# EAGLE design Geiger_counter_uC_section (EAGLE 9.2.2)
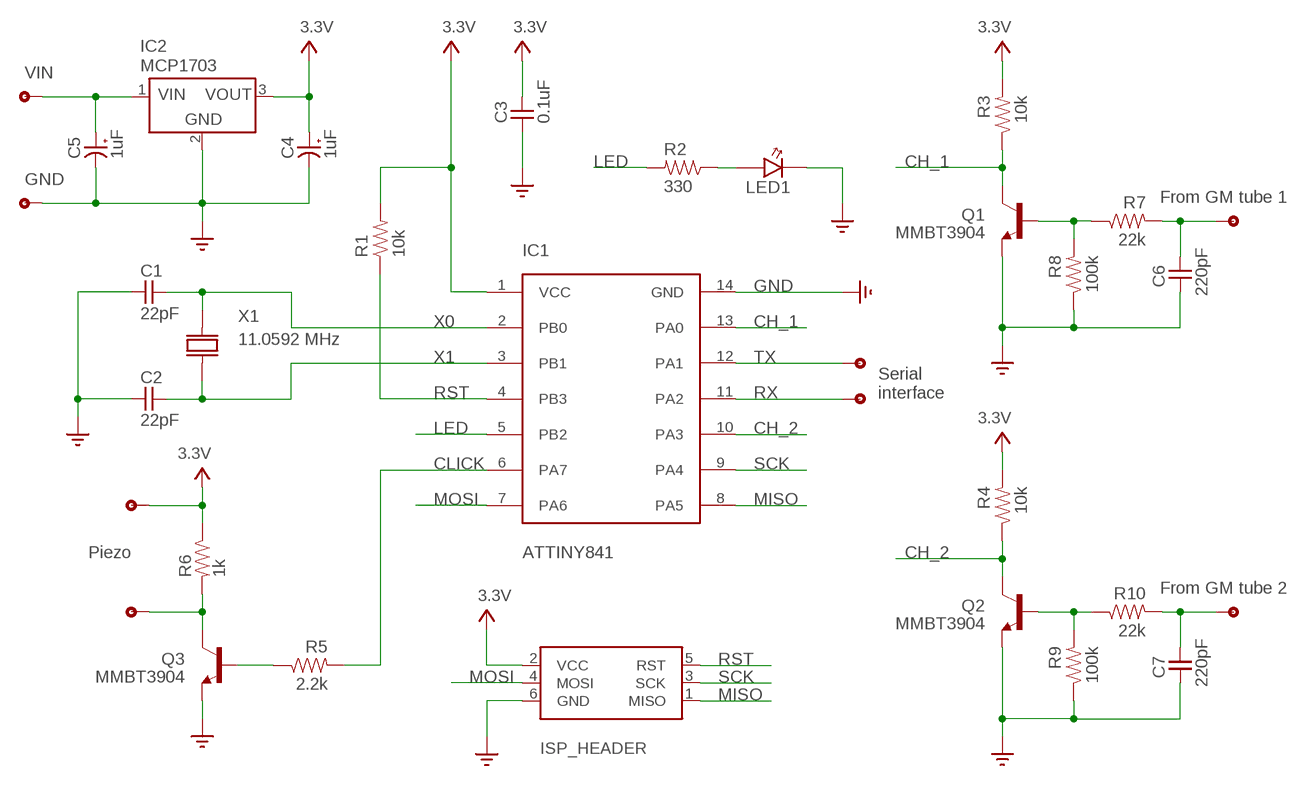
[diagram p0: schematic, sheet 1]

## Parts
C1  22pF  CAPACITOR0805  [0805]
C2  22pF  CAPACITOR0805  [0805]
C3  0.1uF  CAPACITOR0805  [0805]
C4  1uF  CAPACITOR+  [1206]
C5  1uF  CAPACITOR+  [1206]
C6  220pF  CAPACITOR0805  [0805]
C7  220pF  CAPACITOR0805  [0805]
IC1  ATTINY841  ATTINY841SO-14  [SO14]
IC2  MCP1703  [SOT-23A]
ISP_HEADER  ISP header  ISP_HEADER  [ISP_HEADER]
LED1  LED0805  [0805]
Q1  MMBT3904  [SOT-23A]
Q2  MMBT3904  [SOT-23A]
Q3  MMBT3904  [SOT-23A]
R1  10k  RESISTORSMD0805  [0805]
R2  330  RESISTORSMD0805  [0805]
R3  10k  RESISTORSMD0805  [0805]
R4  10k  RESISTORSMD0805  [0805]
R5  2.2k  RESISTORSMD0805  [0805]
R6  1k  RESISTORSMD0805  [0805]
R7  22k  RESISTORSMD0805  [0805]
R8  100k  RESISTORSMD0805  [0805]
R9  100k  RESISTORSMD0805  [0805]
R10  22k  RESISTORSMD0805  [0805]
TP1  TPSMALL  [TP_SMALL]
TP2  TPSMALL  [TP_SMALL]
TP3  TPSMALL  [TP_SMALL]
TP4  TPSMALL  [TP_SMALL]
TP5  TP  [TP]
TP6  TP  [TP]
TP7  TPSMALL  [TP_SMALL]
TP8  TPSMALL  [TP_SMALL]
X1  11.0592 MHz  ABM3  [ABM3-2SMD]

## Nets
3V3: C3.2 C4.1 IC1.1(VCC) IC2.3(VOUT) ISP_HEADER.2(VCC) R1.2 R3.2 R4.2 R6.1 TP4.TP_SMALL ; supply symbol labelled 3.3V
CH_1: IC1.13(PA0) Q1.1(C) R3.1
CH_2: IC1.10(PA3) Q2.1(C) R4.1
CLICK: IC1.6(PA7) R5.2
GND: C1.1 C2.1 C3.1 C4.2 C5.2 C6.2 C7.2 IC1.14(GND) IC2.2(GND) ISP_HEADER.6(GND) LED1.2(K) Q1.3(E) Q2.3(E) Q3.3(E) R8.1 R9.1 TP8.TP_SMALL ; supply symbol labelled DGND
LED: IC1.5(PB2) R2.2
MISO: IC1.8(PA5) ISP_HEADER.1(MISO)
MOSI: IC1.7(PA6) ISP_HEADER.4(MOSI)
N$1: LED1.1(A) R2.1
N$2: Q3.2(B) R5.1
N$3: Q3.1(C) R6.2 TP3.TP_SMALL
N$4: Q1.2(B) R7.1 R8.2
N$5: C6.1 R7.2 TP5.P$1
N$6: Q2.2(B) R9.2 R10.1
N$8: C7.1 R10.2 TP6.P$1
RST: IC1.4(PB3) ISP_HEADER.5(RST) R1.1
RX: IC1.11(PA2) TP2.TP_SMALL
SCK: IC1.9(PA4) ISP_HEADER.3(SCK)
TX: IC1.12(PA1) TP1.TP_SMALL
VIN: C5.1 IC2.1(VIN) TP7.TP_SMALL
X0: C1.2 IC1.2(PB0) X1.P$2
X1: C2.2 IC1.3(PB1) X1.P$1

## Notes on the sheet
- From GM tube 1
- Serial
  interface
- Piezo
- From GM tube 2

## Library data of the parts
C1-C3 C6 C7 = thomas_library:CAPACITOR: This is a capacitor
C4 C5 = thomas_library:CAPACITOR+: This is a polarized capacitor
IC1 = thomas_library:ATTINY841
IC2 = thomas_library:MCP1703: The MCP1703 is a LDO regulator from Microchip
ISP_HEADER = thomas_library:ISP_HEADER: This is a six-pin ISP header for the ATMega Microcontroller
LED1 = thomas_library:LED: This is a Light-Emitting Diode
Q1-Q3 = thomas_library:MMBT3904: This is a SMT bipolar NPN transistor.
R1-R10 = thomas_library:RESISTOR: This is a resistor
TP1-TP8 = thomas_library:TP: A test point
X1 = thomas_library:ABM3: ABM3 crystal from Abracom

## Board
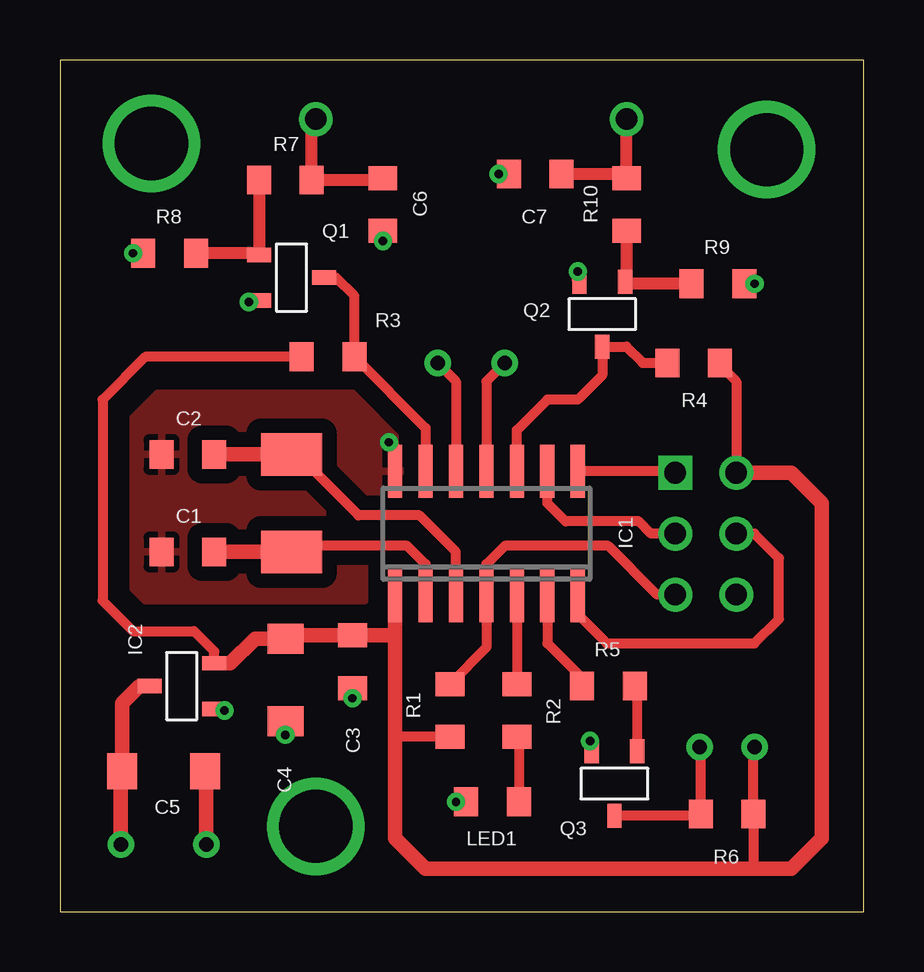
[diagram p1: board, top side]
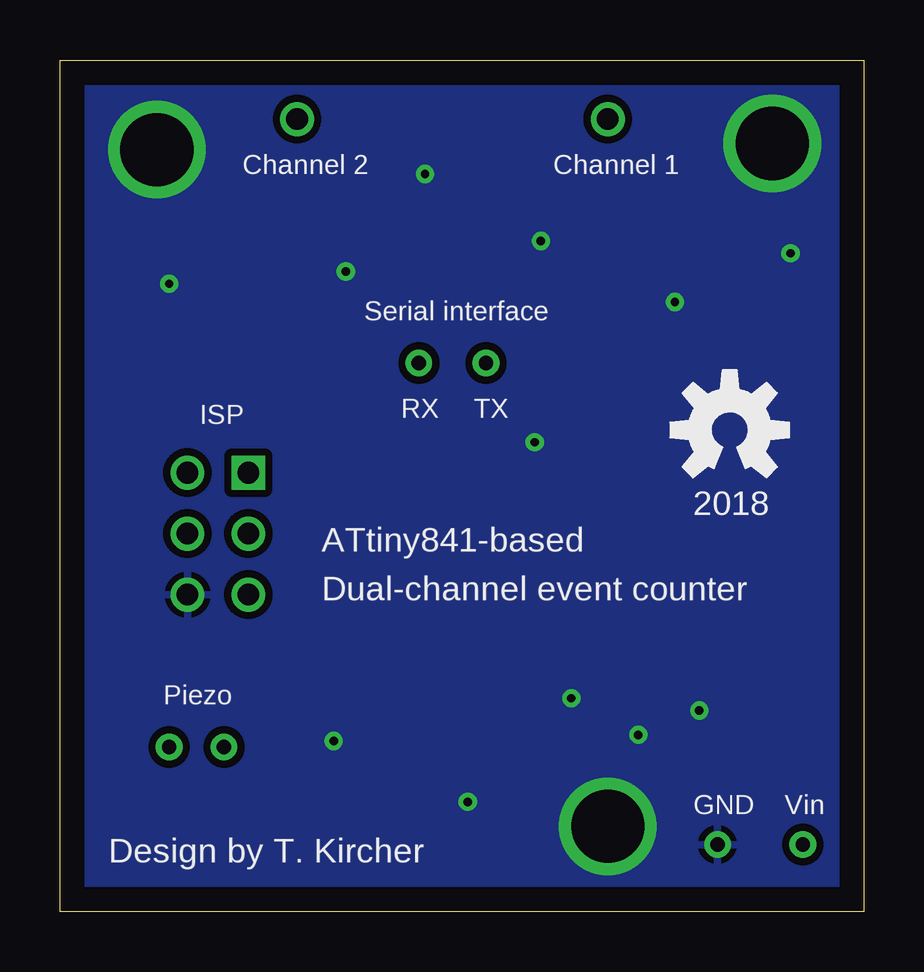
[diagram p2: board, bottom side, seen from below]

Size 33.51 x 35.48 mm. Coordinates in mm from the lower left corner, seen from the top.
Outline: 0,0 33.51,0 33.51,35.48 0,35.48 0,0
Copper layers (1*16): Top 0.035mm / dielectric 1.5mm / Bottom 0.035mm
Design rules "default": minimum track width 6mil, minimum drill 0.35mm, track to track 6mil, track to pad 6mil, pad to pad 6mil, via to via 6mil, smd to smd 6mil, copper to edge 40mil, drill to drill 6mil, minimum pad ring 10mil, minimum via ring 8mil, stop-mask expansion 4mil, vias tented up to drill 0mil, thermal gap 10mil

### Footprints (pad centres in the part's own frame; a part is rotated, then mirrored left to right if it is on the bottom)
0805 = smd 1 x 1.2: 1 -1.1,0; 2 1.1,0
1206 = smd 1.25 x 1.5: 1 -1.725,0; 2 1.725,0
SO14 = smd 0.6 x 2.2: 1 -3.81,-2.6; 2 -2.54,-2.6; 3 -1.27,-2.6; 4 0,-2.6; 5 1.27,-2.6; 6 2.54,-2.6; 7 3.81,-2.6; 8 3.81,2.6; 9 2.54,2.6; 10 1.27,2.6; 11 0,2.6; 12 -1.27,2.6; 13 -2.54,2.6; 14 -3.81,2.6
SOT-23A = smd 0.6 x 1: 1 0,1.35; 2 -0.95,-1.35; 3 0.95,-1.35
ISP_HEADER = drill 0.9 square: 1 -2.54,-1.27 | drill 0.9: 2 -2.54,1.27; 3 0,-1.27; 4 0,1.27; 5 2.54,-1.27; 6 2.54,1.27
TP_SMALL = drill 0.6: TP_SMALL 0,0
TP = drill 0.9: P$1 0,0
ABM3-2SMD = smd 1.778 x 2.54: P$1 -2.032,0; P$2 2.032,0

### Placement (x,y rotation side)
C1  5.33,14.99 0 top
C2  5.33,19.05 0 top
C3  12.19,10.41 90 top
C4  9.4,9.65 270 top
C5  4.32,5.84 0 top
C6  13.46,29.46 270 top
C7  19.81,30.73 180 top
IC1  ATTINY641  [SO14]  17.78,15.75 0 top
IC2  5.08,9.4 90 top
ISP_HEADER  26.92,15.75 270 top
LED1  18.03,4.57 180 top
Q1  9.65,26.42 270 top
Q2  22.61,24.89 180 top
Q3  23.11,5.33 180 top
R1  16.26,8.38 270 top
R2  19.05,8.38 90 top
R3  11.18,23.11 180 top
R4  26.42,22.86 0 top
R5  22.86,9.4 180 top
R6  27.81,4.06 180 top
R7  9.4,30.48 0 top
R8  4.57,27.43 0 top
R9  27.43,26.16 180 top
R10  23.62,29.46 90 top
TP1  15.75,22.86 0 top
TP2  18.54,22.86 0 top
TP3  26.67,6.86 0 top
TP4  28.96,6.86 0 top
TP5  10.67,33.02 0 top
TP6  23.62,33.02 0 top
TP7  2.54,2.79 0 top
TP8  6.1,2.79 0 top
U$17  [OSHW-LOGO-M]  5.59,20.07 0 bottom
X1  9.65,17.02 270 top

### Tracks (layer width: path | path; a pad name or v marks a point on that pad's centre or on a via)
3V3
  Top 0.406: R1.2 14.05,7.28 13.97,7.37 | TP4.TP_SMALL 28.91,6.81 R6.1 28.91,1.82 28.96,1.78 | R4.2 27.52,22.78 28.19,22.1 ISP_HEADER.2 | R3.2 3.56,23.11 1.78,21.34 1.78,12.95 3.05,11.68 5.59,11.68 6.43,10.84 IC2.3
  Top 0.61: 13.97,11.51 13.97,7.37 13.97,3.05 15.24,1.78 28.96,1.78 30.48,1.78 31.75,3.05 31.75,17.02 30.48,18.29 ISP_HEADER.2 | C3.2 12.08,11.63 | C3.2 13.97,11.51 | C3.2 9.53,11.51 C4.1 8.13,11.38 7.1,10.35 IC2.3 | 13.97,11.51 IC1.1
CH_1
  Top 0.406: Q1.1 11.51,26.42 12.27,25.65 R3.1 15.24,20.15 IC1.13
CH_2
  Top 0.406: IC1.10 19.05,20.07 20.32,21.34 21.59,21.34 22.61,22.35 Q2.1 23.62,23.54 24.3,22.86 R4.1
CLICK
  Top 0.406: IC1.6 20.32,11.18 21.76,9.74 R5.2
GND  (via drill 0.35, 3.05)
  Top 0.508: Q1.3 8.24,25.4 v7.87,25.4 | C7.2 v18.29,30.73 | v28.96,26.16 R9.1 | v21.59,26.67 21.59,26.31 Q2.3 | C3.1 v12.19,8.89 | LED1.2 v16.51,4.57 | Q3.3 22.16,7.05 v22.1,7.11 | IC1.14 13.97,19.3 v13.72,19.56 | C4.2 v9.4,7.37 | v6.86,8.38 6.5,8.38 IC2.2
  Top 0.61: C5.2 6.1,5.79 TP8.TP_SMALL | C6.2 v13.46,27.94 | R8.1 v3.05,27.43
  other vias: 3.81,32 29.46,31.75 10.67,3.56
  pour Bottom (isolate 0.305): -0.25,36.07 -0.25,-0.25 33.78,-0.25 33.78,36.07
  pour Top (isolate 0.61): 14.22,19.56 12.19,21.59 4.06,21.59 3.05,20.57 3.05,13.46 3.56,12.95 12.7,12.95 12.7,16 14.22,17.53
LED
  Top 0.406: IC1.5 R2.2
MISO
  Top 0.406: IC1.8 25.59,18.35 ISP_HEADER.1
MOSI
  Top 0.406: IC1.7 21.59,12.39 22.8,11.18 28.96,11.18 29.97,12.19 29.97,14.73 28.96,15.75 ISP_HEADER.4
N$1
  Top 0.406: R2.1 19.13,7.2 LED1.1
N$2
  Top 0.406: Q3.2 24.06,9.13 24.04,9.42 R5.1
N$3
  Top 0.406: Q3.1 26.63,3.98 R6.2 26.71,6.86 TP3.TP_SMALL
N$4
  Top 0.508: Q1.2 8.24,27.43 | 8.24,27.43 R8.2 | R7.1 8.3,27.49 8.24,27.43
N$5
  Top 0.508: C6.1 13.38,30.48 R7.2 10.5,32.85 TP5.P$1
N$6
  Top 0.508: R9.2 23.64,26.16 Q2.2 23.62,26.31 R10.1
N$8
  Top 0.508: C7.1 23.45,30.73 R10.2 TP6.P$1
RST
  Top 0.406: ISP_HEADER.5 24.89,13.21 22.86,15.24 18.54,15.24 17.78,14.48 IC1.4 17.78,11.01 R1.1
RX
  Top 0.406: TP2.TP_SMALL 17.78,22.1 IC1.11
SCK
  Top 0.406: ISP_HEADER.3 24.64,15.75 24.13,16.26 21.08,16.26 20.32,17.02 IC1.9
TX
  Top 0.406: TP1.TP_SMALL 16.51,22.1 IC1.12
VIN
  Top 0.61: TP7.TP_SMALL 2.54,5.79 C5.1 2.59,8.69 3.3,9.4 IC2.1
X0
  Top 0.406: IC1.2 15.24,14.48 14.48,15.24 9.91,15.24 X1.P$2
  Top 0.61: X1.P$2 C1.2
X1
  Top 0.406: IC1.3 16.51,14.99 14.99,16.51 12.45,16.51 9.91,19.05 X1.P$1
  Top 0.61: X1.P$1 C2.2

### Text on the board
bNames: Channel 1 | Channel 2 | Serial interface | TX | RX | ISP | 2018 | ATtiny841-based | Dual-channel event counter | Piezo | Vin | GND | Design by T. Kircher